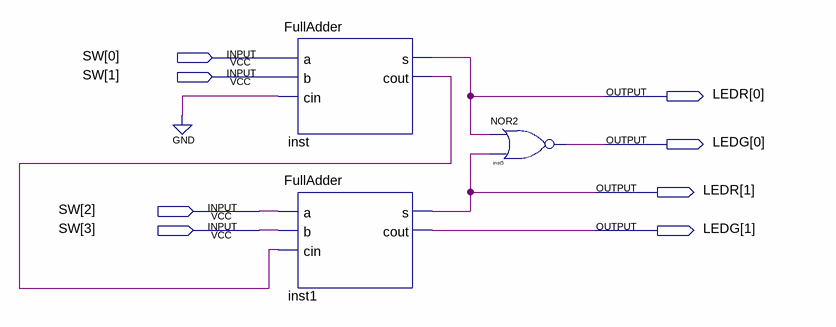
[diagram p0: schematic sheet]
// Quartus schematic FullAddedDemo.bdf as structural Verilog: 3 symbols, 8 pins
module FullAddedDemo (
  input  [3:0] SW,
  output [1:0] LEDR,
  output [1:0] LEDG
);

  wire inst_cout;

  FullAdder inst (.a(SW[0]), .b(SW[1]), .cin(1'b0), .s(LEDR[0]), .cout(inst_cout));
  FullAdder inst1 (.a(SW[2]), .b(SW[3]), .cin(inst_cout), .s(LEDR[1]), .cout(LEDG[1]));
  nor inst5 (LEDG[0], LEDR[0], LEDR[1]);
endmodule
